# EAGLE design soilSensor (EAGLE 9.6.2)
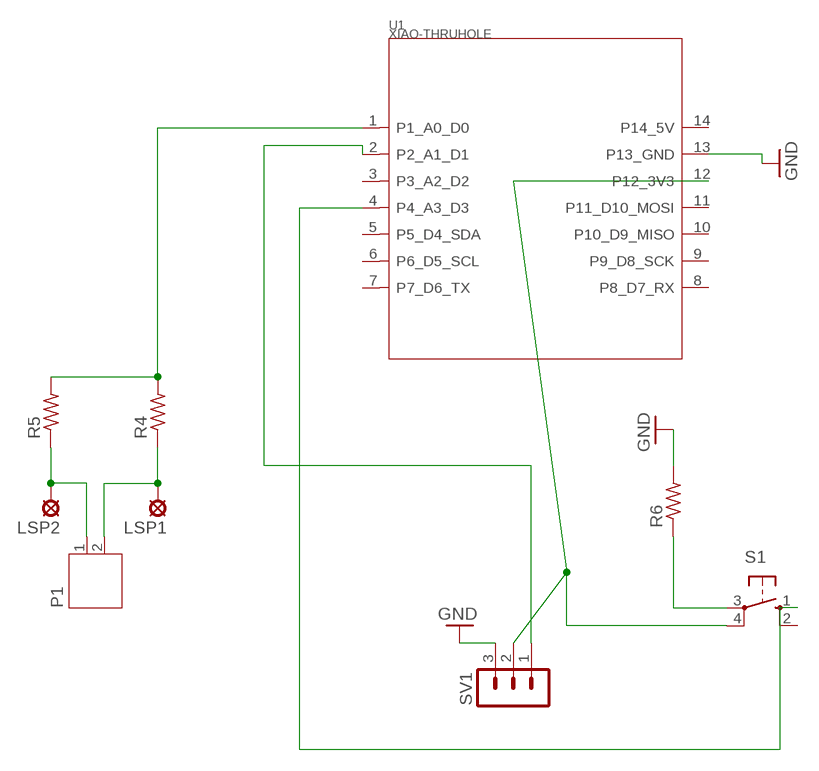
[diagram p0: schematic, sheet 1]

## Parts
LSP1  LSP10  [LSP10]
LSP2  LSP10  [LSP10]
P1  JST-PH2  [JST-PH2]
R4  R-US_0204/7  [0204/7]
R5  R-US_0204/7  [0204/7]
R6  R-US_0204/7  [0204/7]
S1  10-XX  [B3F-10XX]
SV1  MA03-1  [MA03-1]
U1  XIAO-THRUHOLE  [XIAO-GENERIC-THRUHOLE-MODULE14P-2.54-21X17.8MM]

## Nets
GND: R6.2 SV1.3 U1.13(P13_GND)
N$1: R4.2 R5.2 U1.1(P1_A0_D0)
N$2: LSP2.MP P1.1 R5.1
N$3: LSP1.MP P1.2 R4.1
N$5: S1.1(S) U1.4(P4_A3_D3)
N$6: SV1.1 U1.2(P2_A1_D1)
N$7: R6.1 S1.3(P)
N$8: S1.4(P1) SV1.2 U1.12(P12_3V3)
Unconnected: S1.2(S1) U1.3(P3_A2_D2) U1.5(P5_D4_SDA) U1.6(P6_D5_SCL) U1.7(P7_D6_TX) U1.8(P8_D7_RX) U1.9(P9_D8_SCK) U1.10(P10_D9_MISO) U1.11(P11_D10_MOSI) U1.14(P14_5V)

## Library data of the parts
LSP1 LSP2 = solpad:LSP10: SOLDER PAD drill 1.0 mm, distributor Buerklin, 12H555
P1 = jst-ph:JST-PH2
R4-R6 = resistor:R-US_: RESISTOR, American symbol
S1 = switch-omron:10-XX: OMRON SWITCH; MPN: B3F-1000; OC_FARNELL: 176432; OC_NEWARK: 36M3542
SV1 = con-lstb:MA03-1: PIN HEADER; OC_FARNELL: unknown; OC_NEWARK: unknown
U1 = Seeed Studio XIAO Series:XIAO-THRUHOLE: Seeed Studio XIAO Series Through-hole Footprint and Symbol Basic through-hole footprint for Seeed XIAO series of boards. The underside surface mount pads are disabled. For through-hole mounting, a pair of 7-pin, 2.54mm pitch headers with 0.64x0.64mm square leads are recommended. The hybrid variant allows the assembler to choose between surface mount and through-hole mounting methods. However, there is a risk of solder leakage and therefore insufficient solder at the joints if soldering using solder paste and stencils, so we advise using this footprint only when the module is intended to be hand soldered. The symbol pin labels are generic. Please refer to the specific board for more information. Seeed Studio XIAO SAMD21 (Seeeduino XIAO) is also available pre-soldered: Seeed Studio XIAO SAMD21 Pre-soldered - Microchip ATSAMD21G18 Arduino Microcontroller with headers Seeed SKU: 102010388 Buy now <https://www.seeedstudio.com/Seeeduino-XIAO-Pre-Soldered-p-4747.html>

## Net classes
0 default: width 0.305 mm, drill 0.508 mm, clearance 0.254 mm

## Board
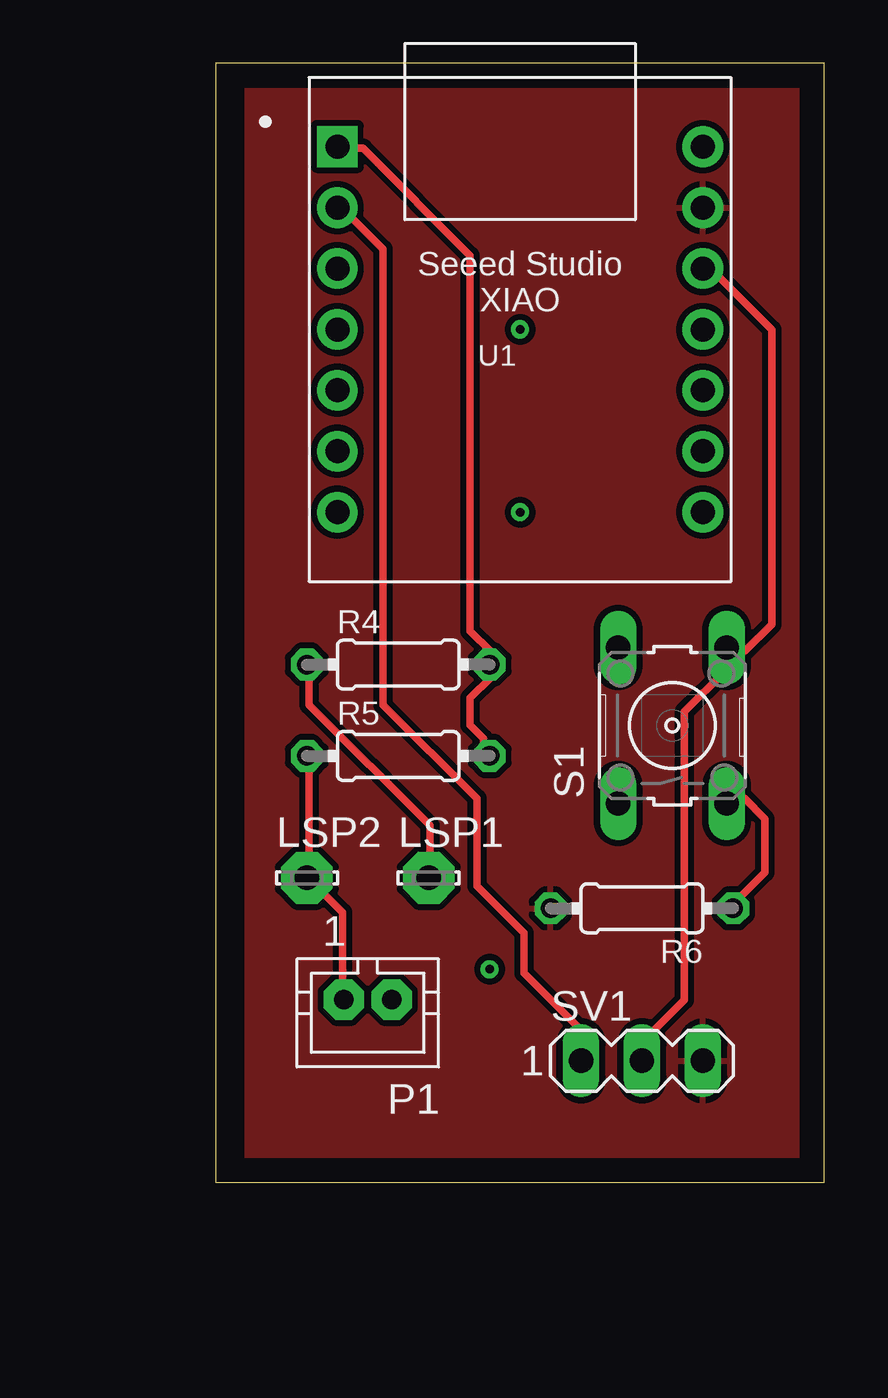
[diagram p1: board, top side]
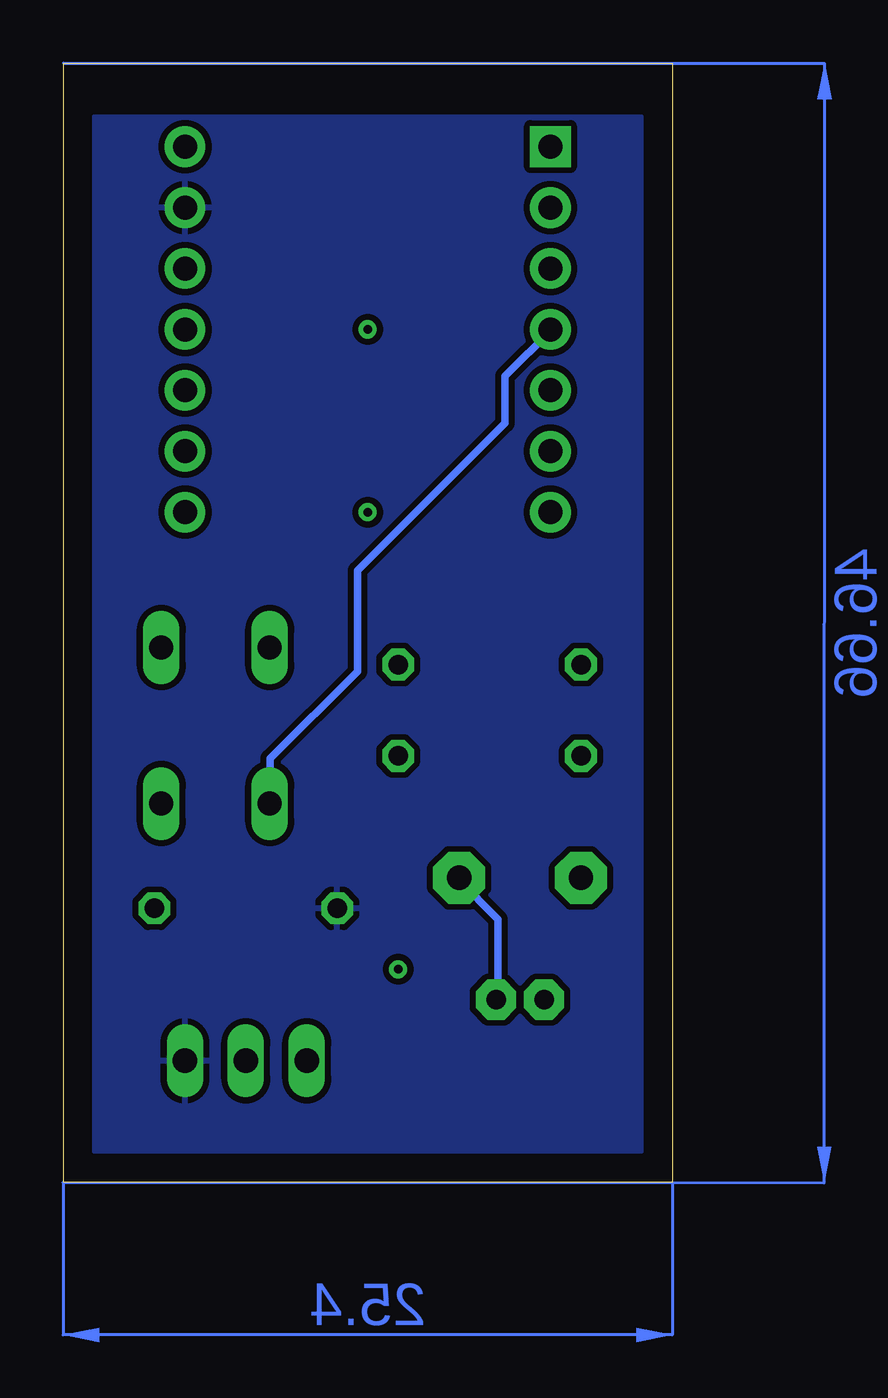
[diagram p2: board, bottom side, seen from below]

Size 25.38 x 46.66 mm. Coordinates in mm from the lower left corner, seen from the top.
Outline: 0,0 25.38,0 25.38,46.66 0,46.66 0,0
Copper layers (1*16): Top 0.035mm / dielectric 1.5mm / Bottom 0.035mm
Design rules "default": minimum track width 6mil, minimum drill 0.35mm, track to track 6mil, track to pad 6mil, pad to pad 6mil, via to via 6mil, smd to smd 6mil, copper to edge 40mil, drill to drill 6mil, minimum pad ring 10mil, minimum via ring 8mil, stop-mask expansion 4mil, vias tented up to drill 0mil, thermal gap 10mil

### Footprints (pad centres in the part's own frame; a part is rotated, then mirrored left to right if it is on the bottom)
LSP10 = drill 1.016 pad 2.159 octagon: MP 0,0
JST-PH2 = drill 0.813 pad 1.676 octagon: 1 1,0; 2 -1,0
0204/7 = drill 0.813 octagon: 1 -3.81,0; 2 3.81,0
B3F-10XX = drill 1.016 long: 1 -3.251,2.261; 2 3.251,2.261; 3 -3.251,-2.261; 4 3.251,-2.261
MA03-1 = drill 1.016 long: 1 -2.54,0; 2 0,0; 3 2.54,0
XIAO-GENERIC-THRUHOLE-MODULE14P-2.54-21X17.8MM = drill 1 pad 1.7 square: 1 -7.62,7.62 | drill 1 pad 1.7: 2 -7.62,5.08; 3 -7.62,2.54; 4 -7.62,0; 5 -7.62,-2.54; 6 -7.62,-5.08; 7 -7.62,-7.62; 8 7.62,-7.62; 9 7.62,-5.08; 10 7.62,-2.54; 11 7.62,0; 12 7.62,2.54; 13 7.62,5.08; 14 7.62,7.62

### Placement (x,y rotation side)
LSP1  8.89,12.7 0 top
LSP2  3.81,12.7 0 top
P1  6.35,7.62 180 top
R4  7.62,21.59 0 top
R5  7.62,17.78 0 top
R6  17.78,11.43 180 top
S1  19.05,19.05 90 top
SV1  17.78,5.08 0 top
U1  12.7,35.56 0 top

### Tracks (layer width: path | path; a pad name or v marks a point on that pad's centre or on a via)
GND
  pour Top: 1.27,45.72 25.4,45.72 25.4,0 1.27,0
  pour Bottom: 1.27,44.45 24.13,44.45 24.13,1.27 1.27,1.27
N$1
  Top 0.305: 11.46,21.59 11.46,21.03 10.62,20.19 10.62,19.08 11.18,18.52 11.18,17.96 R5.2 | 11.46,21.59 11.46,22.15 10.62,22.99 10.62,38.63 6.15,43.1 5.31,43.1 U1.1 | 11.46,21.59 R4.2
N$2
  Top 0.305: R5.1 3.91,17.68 3.91,12.93 LSP2.MP 3.91,12.65 5.31,11.25 5.31,7.62 P1.1
N$3
  Top 0.305: R4.1 3.91,21.59 3.91,19.91 8.94,14.88 8.94,12.93 LSP1.MP
  Bottom 0.305: P1.2 7.26,7.62 7.26,10.97 8.94,12.65 LSP1.MP
N$4  (via drill 0.35)
  other vias: 11.43,8.89
N$5
  Bottom 0.305: S1.1 16.76,16 16.76,17.68 13.13,21.31 13.13,25.5 6.99,31.65 6.99,33.6 5.03,35.56 U1.4
N$6
  Top 0.305: SV1.1 15.09,5.11 15.09,6.5 12.85,8.74 12.85,10.41 10.9,12.37 10.9,16 6.99,19.91 6.99,38.91 5.31,40.59 U1.2
N$7
  Top 0.305: R6.1 21.79,11.53 21.79,11.81 22.91,12.93 22.91,15.16 22.07,16 21.51,16 S1.3
N$8
  Top 0.305: SV1.2 17.88,5.11 17.88,5.94 19.56,7.62 19.56,19.63 21.23,21.31 21.23,22.15 S1.4 21.51,22.15 22.07,22.15 23.19,23.27 23.19,35.56 20.68,38.07 20.4,38.07 U1.12
N$9  (via drill 0.35)
  other vias: 12.7,27.94
N$10  (via drill 0.35)
  other vias: 12.7,35.56
(copper drawn outside any net)
  shapes: Bottom area x2